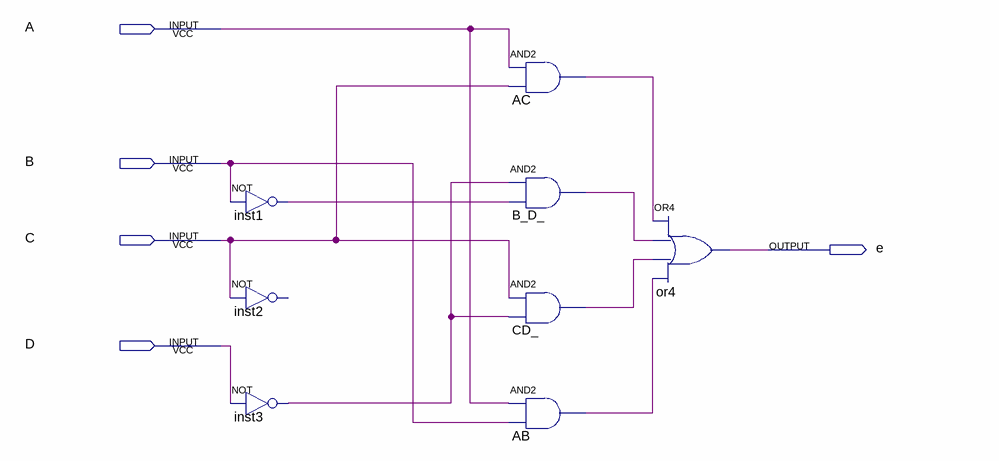
[diagram p0: schematic sheet]
// Quartus schematic output_e.bdf as structural Verilog: 8 symbols, 5 pins
module output_e (
  input  A,
  input  B,
  input  C,
  input  D,
  output e
);

  wire AB_out, AC_out, B_D__out, CD__out, inst1_out, inst3_out;

  not inst1 (inst1_out, B);
  // NOT inst2 has open pins: IN=C, OUT=open
  not inst3 (inst3_out, D);
  and AC (AC_out, A, C);
  and B_D_ (B_D__out, inst3_out, inst1_out);
  and CD_ (CD__out, C, inst3_out);
  and AB (AB_out, A, B);
  or or4 (e, AC_out, B_D__out, CD__out, AB_out);
endmodule
